# EAGLE design AD595 (EAGLE 6.4)
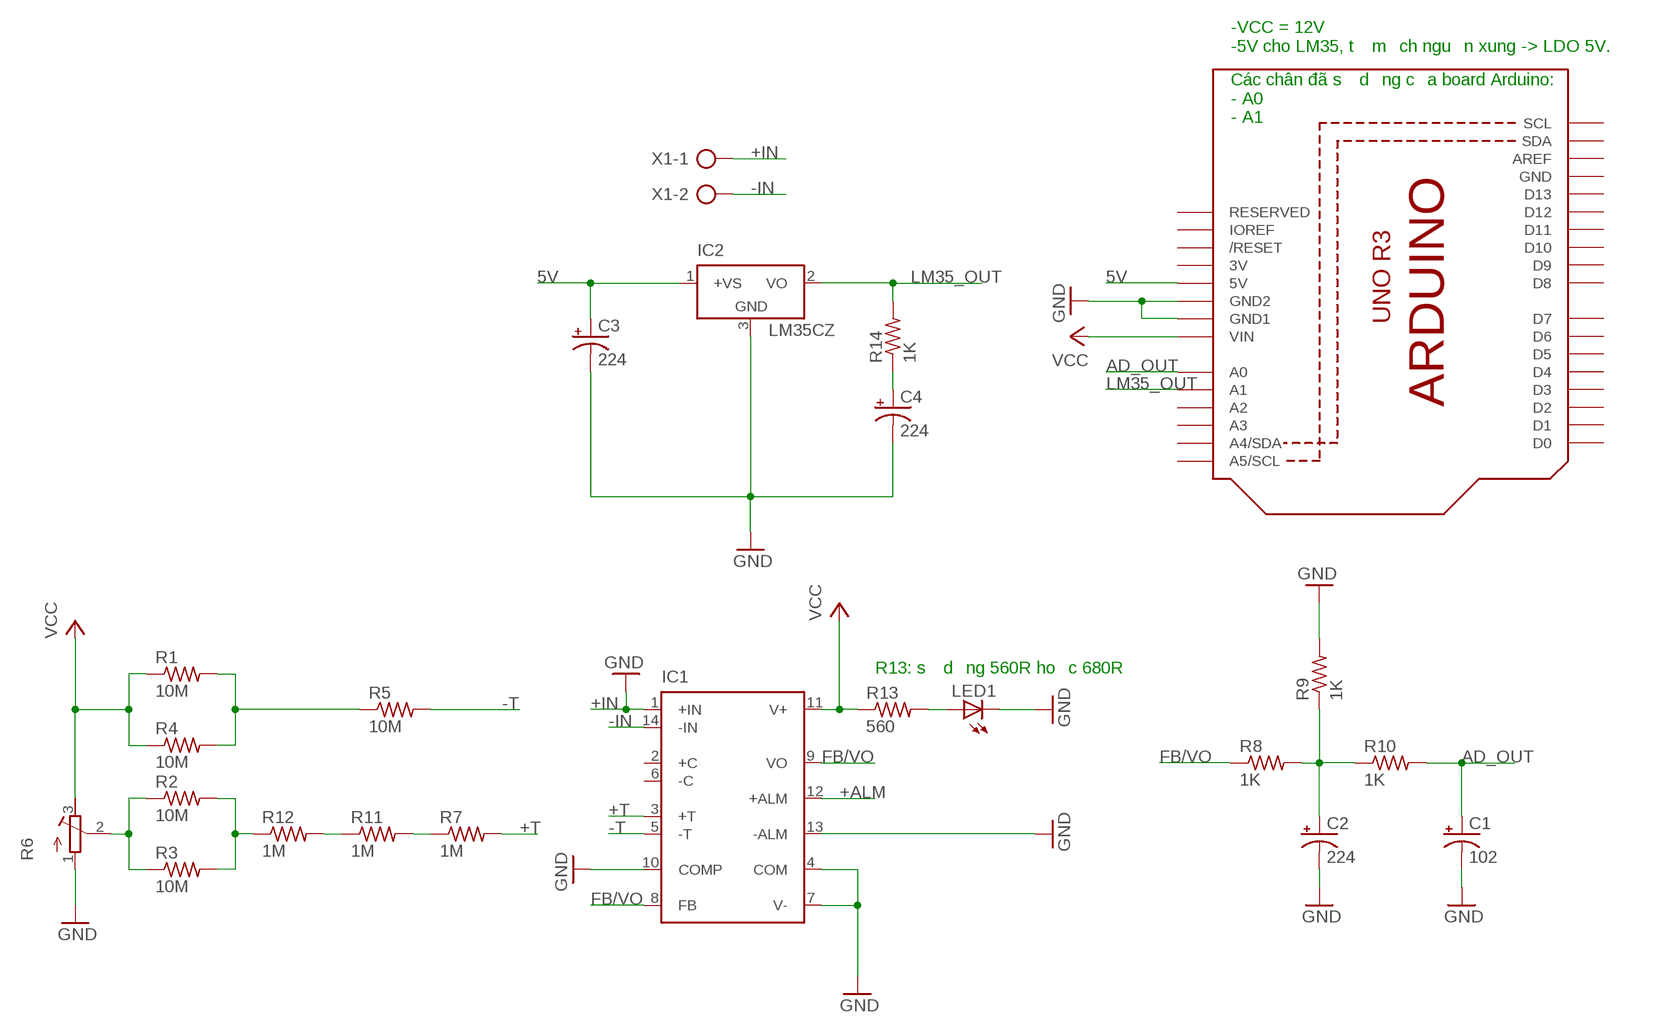
[diagram p0: schematic, sheet 1]

## Parts
C1  102  CPOL-USE2.5-6  [E2,5-6]
C2  224  CPOL-USE2.5-6  [E2,5-6]
C3  224  CPOL-USE2.5-6  [E2,5-6]
C4  224  CPOL-USE2.5-6  [E2,5-6]
IC1  AD595  [DIL14]
IC2  LM35CZ  [TO92]
LED1  LED3MM  [LED3MM]
R1  10M  R-US_0207/10  [0207/10]
R2  10M  R-US_0207/10  [0207/10]
R3  10M  R-US_0207/10  [0207/10]
R4  10M  R-US_0207/10  [0207/10]
R5  10M  R-US_0207/10  [0207/10]
R6  R-TRIMM64W  [RTRIM64W]
R7  1M  R-US_0207/10  [0207/10]
R8  1K  R-US_0207/10  [0207/10]
R9  1K  R-US_0207/10  [0207/10]
R10  1K  R-US_0207/10  [0207/10]
R11  1M  R-US_0207/10  [0207/10]
R12  1M  R-US_0207/10  [0207/10]
R13  560  R-US_0207/10  [0207/10]
R14  1K  R-US_0207/10  [0207/10]
U1  ARDUINOR3-DIMENSION  [ARDUINOR3]
X1  AK500/2-H  [AK500/2-H]

## Nets
5V: C3.+ IC2.1(+VS) U1.5V
+ALM: IC1.12(+ALM)
+IN: IC1.1(+IN) X1.1 ; supply symbol labelled GND
+T: IC1.3(+T) R7.2
-IN: IC1.14(-IN) X1.2
-T: IC1.5(-T) R5.2
AD_OUT: C1.+ R10.2 U1.A0
FB/VO: IC1.8(FB) IC1.9(VO) R8.1
GND: C1.- C2.- C3.- C4.- IC1.4(COM) IC1.7(V-) IC1.10(COMP) IC1.13(-ALM) IC2.3(GND) LED1.K(C) R6.1(E) R9.2 U1.GND1 U1.GND2
LM35_OUT: IC2.2(VO) R14.2 U1.A1
N$1: LED1.A R13.2
N$2: R1.2 R4.2 R5.1
N$3: R2.1 R3.1 R6.2(S)
N$4: R11.1 R12.2
N$5: R2.2 R3.2 R12.1
N$6: R7.1 R11.2
N$7: C4.+ R14.1
N$8: C2.+ R8.2 R9.1 R10.1
VCC: IC1.11(V+) R1.1 R4.1 R6.3(A) R13.1 U1.VIN
Unconnected: IC1.2(+C) IC1.6(-C) U1.A2 U1.A3 U1.A4(A4/SDA) U1.A5(A5/SCL) U1.AREF U1.D0 U1.D1 U1.D2 U1.D3 U1.D4 U1.D5 U1.D6 U1.D7 U1.D8 U1.D9 U1.D10 U1.D11 U1.D12 U1.D13 U1.IOREF U1.RESERVED U1.RESET(/RESET) U1.SCL U1.SDA

## Notes on the sheet
- -VCC = 12V
  -5V cho LM35, từ mạch nguồn xung -> LDO 5V.
- Các chân đã sử dụng của board Arduino:
  - A0
  - A1
- R13: sử dụng 560R hoặc 680R

## Power pins joined to a net without a drawn wire
3V: U1.3V
GND: U1.GND

## Library data of the parts
C1-C4 = rcl:CPOL-US: POLARIZED CAPACITOR, American symbol
IC1 = analog-devices:AD595: ANALOG DEVICES; MPN: AD595AQ; OC_FARNELL: 409194; OC_NEWARK: 06WX1596
IC2 = lm35:LM35: Single-Supply Centigrade Temperature Sensor Vout = (10mV/°C x Temp °C) +5mmmV Source: http://www.national.com/ds/LM/LM35.pdf
LED1 = adafruit:LED: LED OSRAM: - CHIPLED LG R971, LG N971, LY N971, LG Q971, LY Q971, LO R971, LY R971 LH N974, LH R974 LS Q976, LO Q976, LY Q976 LO Q996 - Hyper CHIPLED LW Q18S LB Q993, LB Q99A, LB R99A - SideLED LS A670, LO A670, LY A670, LG A670, LP A670 LB A673, LV A673, LT A673, LW A673 LH A674 LY A675 LS A676, LA A676, LO A676, LY A676, LW A676 LS A679, LY A679, LG A679 - Hyper Micro SIDELED® LS Y876, LA Y876, LO Y876, LY Y876 LT Y87S - SmartLED LW L88C, LW L88S LB L89C, LB L89S, LG L890 LS L89K, LO L89K, LY L89K LS L896, LA L896, LO L896, LY L896 - TOPLED LS T670, LO T670, LY T670, LG T670, LP T670 LSG T670, LSP T670, LSY T670, LOP T670, LYG T670 LG T671, LOG T671, LSG T671 LB T673, LV T673, LT T673, LW T673 LH T674 LS T676, LA T676, LO T676, LY T676, LB T676, LH T676, LSB T676, LW T676 LB T67C, LV T67C, LT T67C, LS T67K, LO T67K, LY T67K, LW E67C LS E67B, LA E67B, LO E67B, LY E67B, LB E67C, LV E67C, LT E67C LW T67C LS T679, LY T679, LG T679 LS T770, LO T770, LY T770, LG T770, LP T770 LB T773, LV T773, LT T773, LW T773 LH T774 LS E675, LA E675, LY E675, LS T675 LS T776, LA T776, LO T776, LY T776, LB T776 LHGB T686 LT T68C, LB T68C - Hyper Mini TOPLED® LB M676 - Mini TOPLED Santana® LG M470 LS M47K, LO M47K, LY M47K Source: http://www.osram.convergy.de/
R1-R5 R7-R14 = resistor:R-US_: RESISTOR, American symbol
R6 = resistor:R-TRIMM: Trimm resistor
U1 = adafruit:ARDUINOR3: This is a new object for the new Arduino R3 - with extra pins that you may want to use (such as IOref, and duplicated A4/A5
X1 = con-ptr500:AK500/2-H: CONNECTOR Aug. 2004 / PTR Meßtechnik: Die Bezeichnung der Serie AK505 wurde geändert. Es handelt sich hierbei um AK500 in horizontaler Ausführung.; OC_FARNELL: unknown; OC_NEWARK: unknown

## Board
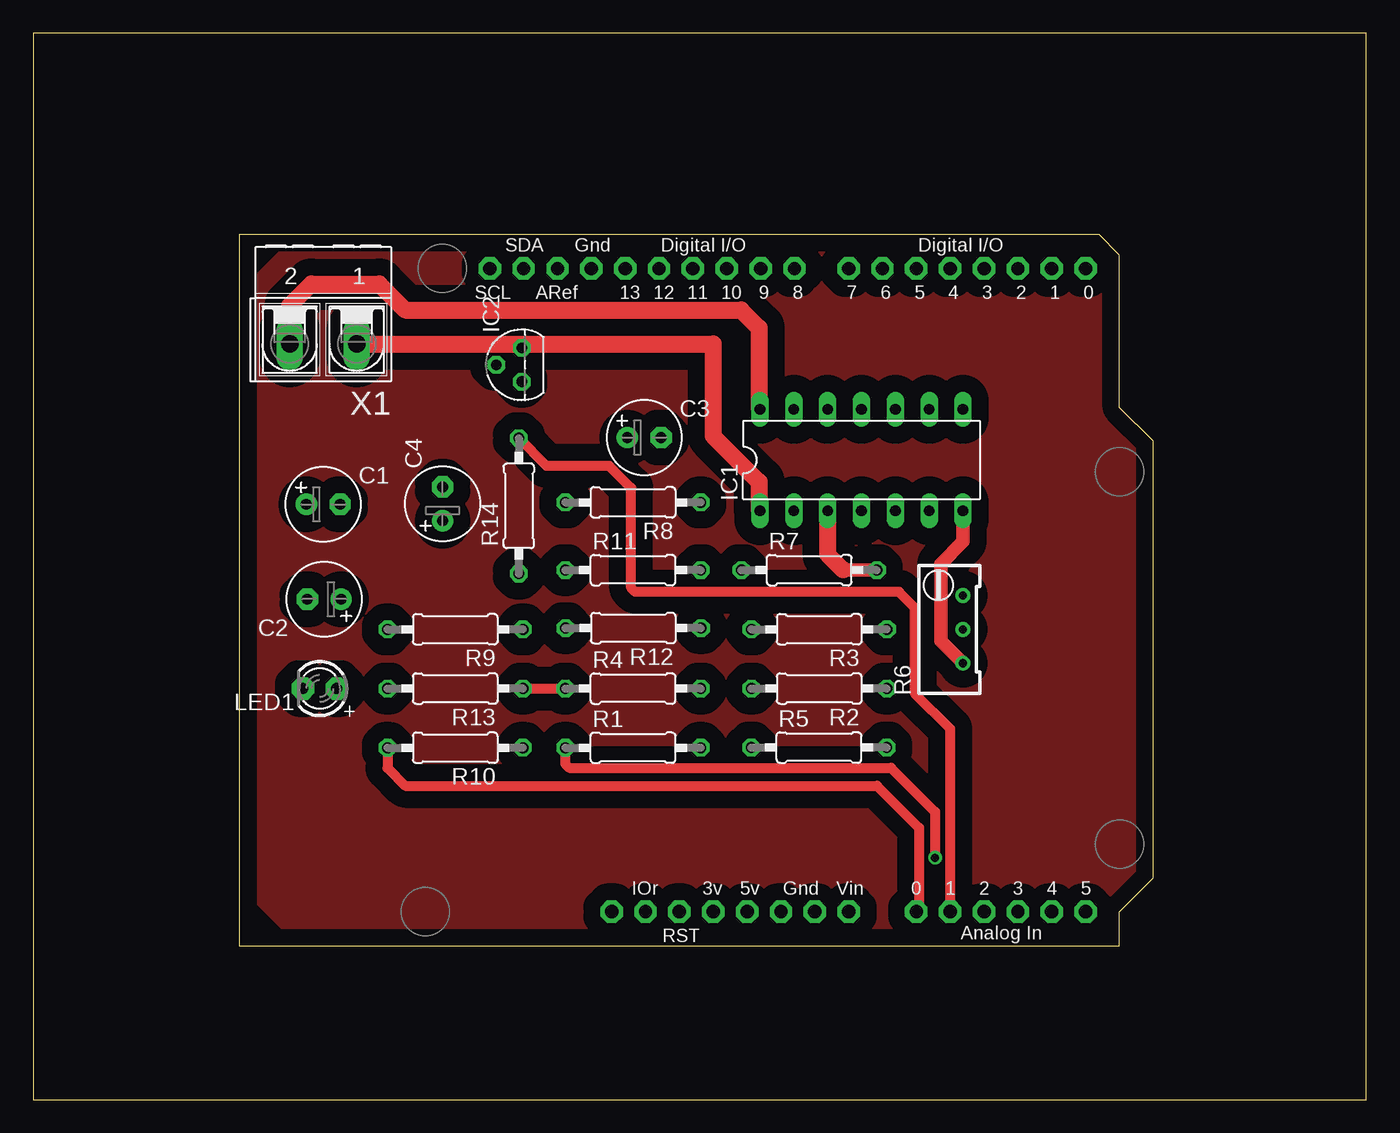
[diagram p1: board, top side]
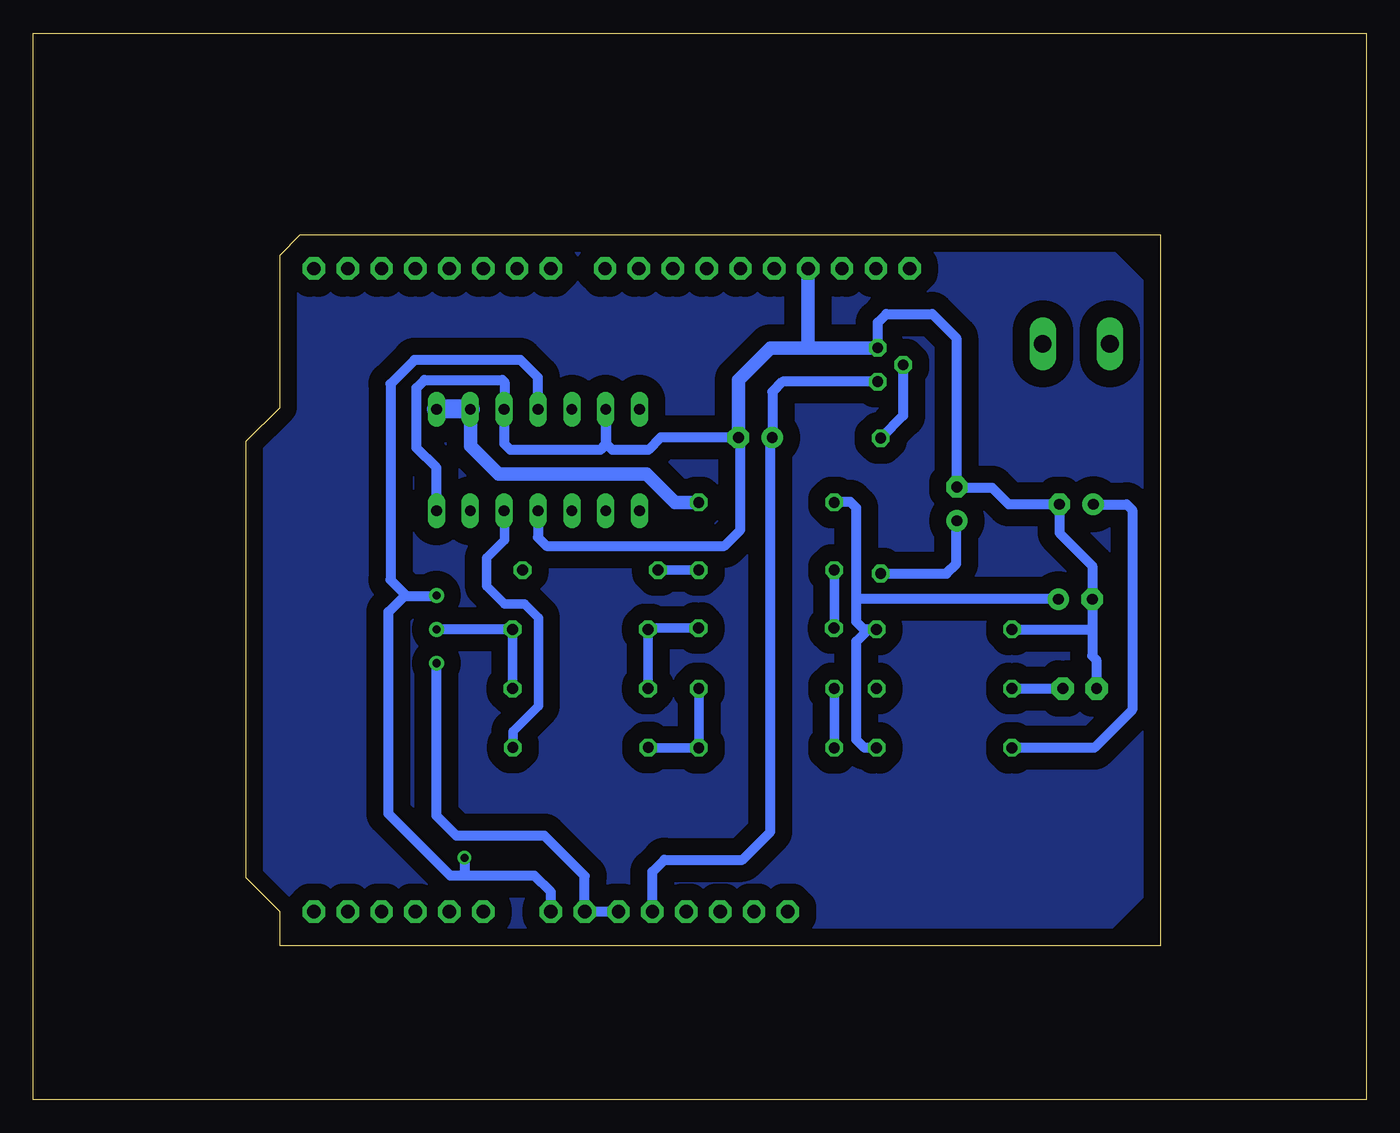
[diagram p2: board, bottom side, seen from below]

Size 100 x 80 mm. Coordinates in mm from the lower left corner, seen from the top.
Outline: 0,0 100,0 100,80 0,80 0,0
Copper layers (1*16): Top 0.035mm / dielectric 1.5mm / Bottom 0.035mm
Design rules "default": minimum track width 10mil, minimum drill 24mil, track to track 8mil, track to pad 8mil, pad to pad 8mil, via to via 8mil, smd to smd 8mil, copper to edge 40mil, drill to drill 8mil, minimum pad ring 10mil, minimum via ring 8mil, stop-mask expansion 4mil, vias tented up to drill 0mil, thermal gap 10mil

### Footprints (pad centres in the part's own frame; a part is rotated, then mirrored left to right if it is on the bottom)
E2,5-6 = drill 0.813 pad 1.6: + -1.27,0 | drill 0.813 pad 1.6 octagon: - 1.27,0
DIL14 = drill 0.813 long: 1 -7.62,-3.81; 2 -5.08,-3.81; 3 -2.54,-3.81; 4 0,-3.81; 5 2.54,-3.81; 6 5.08,-3.81; 7 7.62,-3.81; 8 7.62,3.81; 9 5.08,3.81; 10 2.54,3.81; 11 0,3.81; 12 -2.54,3.81; 13 -5.08,3.81; 14 -7.62,3.81
TO92 = drill 0.813 octagon: 1 -1.27,0; 2 0,1.905; 3 1.27,0
LED3MM = drill 0.813 pad 1.676 octagon: A -1.27,0; K 1.27,0
0207/10 = drill 0.813 octagon: 1 -5.08,0; 2 5.08,0
RTRIM64W = drill 0.61: 1 1.27,-2.54; 2 1.27,0; 3 1.27,2.54
ARDUINOR3 = drill 1 pad 1.676 octagon: 3V 35.56,2.54; 5V 38.1,2.54; A0 50.8,2.54; A1 53.34,2.54; A2 55.88,2.54; A3 58.42,2.54; A4 60.96,2.54; A5 63.5,2.54; AREF 23.876,50.8; D0 63.5,50.8; D1 60.96,50.8; D2 58.42,50.8; D3 55.88,50.8; D4 53.34,50.8; D5 50.8,50.8; D6 48.26,50.8; D7 45.72,50.8; D8 41.656,50.8; D9 39.116,50.8; D10 36.576,50.8; D11 34.036,50.8; D12 31.496,50.8; D13 28.956,50.8; GND 26.416,50.8; GND1 43.18,2.54; GND2 40.64,2.54; IOREF 30.48,2.54; RESERVED 27.94,2.54; RESET 33.02,2.54; SCL 18.796,50.8; SDA 21.336,50.8; VIN 45.72,2.54
AK500/2-H = drill 1.321 long: 1 -2.515,0; 2 2.515,0

### Placement (x,y rotation side)
C1  21.75,44.66 0 top
C2  21.82,37.54 180 top
C3  45.83,49.67 0 top
C4  30.7,44.7 90 top
IC1  62.13,47.98 0 top
IC2  36.65,55.13 90 top
LED1  21.5,30.84 180 top
R1  44.99,26.39 0 top
R2  58.96,30.84 180 top
R3  58.96,35.28 180 top
R4  44.99,30.84 0 top
R5  58.94,26.41 0 top
R6  68.48,35.28 0 top
R7  58.21,39.73 0 top
R8  44.99,44.8 180 top
R9  31.66,35.28 180 top
R10  31.66,26.39 180 top
R11  44.99,39.73 0 top
R12  45.01,35.37 180 top
R13  31.66,30.84 180 top
R14  36.42,44.55 90 top
U1  15.45,11.55 0 top
X1  21.75,56.7 180 top

### Tracks (layer width: path | path; a pad name or v marks a point on that pad's centre or on a via)
5V
  Bottom 0.762: U1.5V 53.55,17.1 52.65,18 46.8,18 44.7,20.1 44.7,49.53 C3.+ 44.55,53.1 43.79,53.86 IC2.1
+IN
  Top 1.27: X1.1 51,56.7 51,49.8 54.45,46.35 54.45,44.23 IC1.1
+T
  Top 1.016: 60.75,39.75 63.27,39.75 R7.2
  Top 1.27: IC1.3 59.59,40.91 60.75,39.75
-IN
  Top 1.27: X1.2 19.23,59.59 20.85,61.2 25.95,61.2 27.9,59.25 53.1,59.25 54.45,57.9 54.45,51.85 IC1.14
-T
  Bottom 0.7: R5.2 64.02,27.63 62.1,29.55 62.1,36.15 63.15,37.2 64.65,37.2 66,38.55 66,40.65 64.65,42 64.65,44.15 IC1.5
AD_OUT
  Top 0.762: R10.2 26.57,24.88 27.9,23.55 63.3,23.55 66.45,20.4 66.45,14.29 U1.A0
  Bottom 0.762: C1.+ 17.96,44.66 17.55,44.25 17.55,29.25 20.4,26.4 26.57,26.4 R10.2
FB/VO
  Bottom 1.016: R8.1 51.85,44.8 54,46.95 65.1,46.95 67.2,49.05 67.2,51.77 IC1.9
  Bottom 1.422: IC1.9 IC1.8
GND
  Top 1.016: IC1.7 69.75,41.85 68.1,40.2 68.1,34.4 R6.1
  Bottom 0.762: 20.55,35.4 C2.- 20.55,40.05 23.02,42.52 C1.- 26.81,44.66 28.05,45.9 30.64,45.9 C4.- 30.75,46.01 30.75,57.15 32.55,58.95 36,58.95 36.65,58.3 IC2.3 | 20.55,35.4 20.55,33.3 20.25,33 20.25,30.86 LED1.K | R9.2 20.67,35.28 20.55,35.4 | U1.GND2 U1.GND1 58.63,16.78 61.65,19.8 68.25,19.8 69.75,21.3 R6.1 | IC1.4 62.13,42.19 61.5,41.55 48.15,41.55 46.95,42.75 46.95,49.52 C3.- 52.93,49.67 53.85,48.75 56.55,48.75 57,49.2 57,51.73 IC1.13 57.05,49.15 57.45,48.75 64.2,48.75 64.65,49.2 64.65,51.77 IC1.10 64.65,51.81 64.65,53.85 64.8,54 70.65,54 71.25,53.4 71.25,48.9 69.75,47.41 IC1.7
  Bottom 1.016: IC2.3 41.85,56.4 | 41.85,56.4 44.7,56.4 47.1,54 C3.- | U1.GND 41.87,56.42 41.85,56.4
LM35_OUT
  Top 0.762: U1.A1 68.79,27.81 66.15,30.45 66.15,36.9 64.95,38.1 45.15,38.1 44.85,38.4 44.85,45.9 43.2,47.55 38.5,47.55 R14.2
  Bottom 0.762: IC2.2 34.74,51.31 R14.2
N$1
  Bottom 0.762: R13.2 LED1.A
N$2
  Bottom 0.7: R4.2 R1.2 53.84,26.39 R5.1
N$3
  Bottom 0.7: R3.1 R2.1
  Bottom 0.762: R3.1 R6.2
N$4
  Bottom 0.7: R11.1 39.91,35.39 R12.2
N$5
  Bottom 0.7: R2.2 R3.2 53.79,35.37 R12.1
N$6
  Bottom 0.7: R7.1 R11.2
N$7
  Bottom 0.762: R14.1 31.48,39.47 30.75,40.2 30.75,43.38 C4.+
N$8
  Bottom 0.762: R9.1 37.35,35.28 | 37.35,35.28 37.68,35.28 38.25,35.85 38.25,37.65 | 38.25,37.65 38.25,44.4 38.7,44.85 39.87,44.85 R8.2 | C2.+ 38.14,37.54 38.25,37.65 | R10.1 37.64,26.39 38.25,27 38.25,34.38 37.35,35.28
N$9
  pour Bottom (isolate 1.27): 80.55,12.15 19.8,12.15 16.35,15.6 16.35,61.05 19.8,64.5 79.65,64.5 81.3,62.85 81.3,51.6 84,48.9 84,16.95 81.3,14.25 81.3,12.15
N$10
  pour Top (isolate 1.27): 18.75,12.75 80.1,12.75 81.6,14.25 83.85,16.5 83.85,49.65 81.3,52.2 81.3,63.3 80.1,64.5 19.35,64.5 16.65,61.8 16.65,14.85
VCC  (via drill 0.6)
  Top 0.762: R13.1 R4.1 | R1.1 39.91,25.19 40.2,24.9 64.35,24.9 67.65,21.6 v67.65,18.15
  Bottom 0.7: R1.1 R4.1
  Bottom 0.762: IC1.11 62.13,54.19 63.45,55.5 71.4,55.5 73.2,53.7 73.2,39 72.08,37.88 | 72.08,37.88 72,37.8 69.78,37.8 R6.3 | U1.VIN 61.17,15.57 62.4,16.8 67.65,16.8 | 67.65,16.8 68.7,16.8 73.35,21.45 73.35,36.6 72.08,37.88 | v67.65,18.15 67.65,16.8